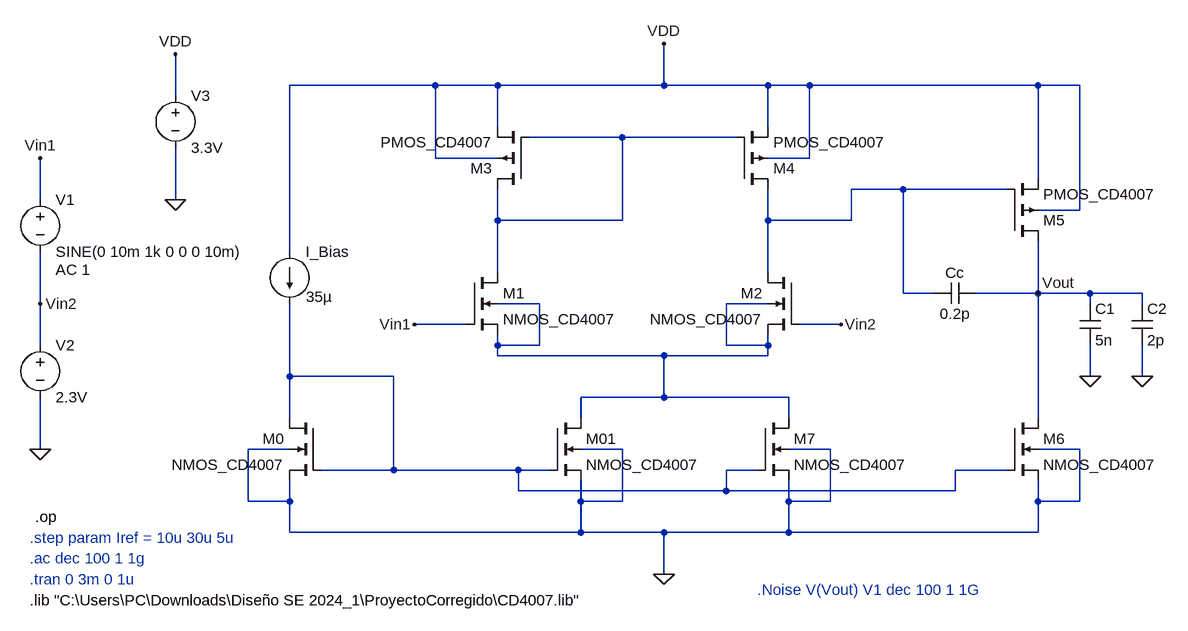
[diagram p0: schematic OTA_ADD_CurrentMirror.asc]
OTA_ADD_CurrentMirror.asc, the LTspice schematic file:
Version 4
SHEET 1 1976 948
WIRE 832 -64 608 -64
WIRE 928 -64 832 -64
WIRE 1184 -64 1184 -128
WIRE 1184 -64 928 -64
WIRE 1344 -64 1184 -64
WIRE 1408 -64 1344 -64
WIRE 1760 -64 1408 -64
WIRE 1824 -64 1760 -64
WIRE 432 -48 432 -112
WIRE 928 0 928 -64
WIRE 1344 0 1344 -64
WIRE 1120 16 976 16
WIRE 1296 16 1120 16
WIRE 832 48 832 -64
WIRE 928 48 832 48
WIRE 1408 48 1408 -64
WIRE 1408 48 1344 48
WIRE 1760 80 1760 -64
WIRE 1552 96 1472 96
WIRE 1712 96 1552 96
WIRE 224 112 224 48
WIRE 432 112 432 32
WIRE 1824 128 1824 -64
WIRE 1824 128 1760 128
WIRE 928 144 928 96
WIRE 1120 144 1120 16
WIRE 1120 144 928 144
WIRE 1344 144 1344 96
WIRE 1472 144 1472 96
WIRE 1472 144 1344 144
WIRE 608 192 608 -64
WIRE 928 224 928 144
WIRE 1344 224 1344 144
WIRE 1552 256 1552 96
WIRE 1600 256 1552 256
WIRE 1760 256 1760 176
WIRE 1760 256 1664 256
WIRE 1840 256 1760 256
WIRE 1920 256 1840 256
WIRE 224 272 224 192
WIRE 992 272 928 272
WIRE 1344 272 1280 272
WIRE 1840 272 1840 256
WIRE 1920 272 1920 256
WIRE 880 304 800 304
WIRE 1456 304 1392 304
WIRE 224 336 224 272
WIRE 928 336 928 320
WIRE 992 336 992 272
WIRE 992 336 928 336
WIRE 1280 336 1280 272
WIRE 1344 336 1344 320
WIRE 1344 336 1280 336
WIRE 928 352 928 336
WIRE 1184 352 928 352
WIRE 1344 352 1344 336
WIRE 1344 352 1184 352
WIRE 608 384 608 272
WIRE 768 384 608 384
WIRE 1840 384 1840 336
WIRE 1920 384 1920 336
WIRE 1184 416 1184 352
WIRE 1184 416 1056 416
WIRE 1376 416 1184 416
WIRE 608 448 608 384
WIRE 1056 448 1056 416
WIRE 1376 448 1376 416
WIRE 1760 448 1760 256
WIRE 224 496 224 416
WIRE 608 496 544 496
WIRE 1120 496 1056 496
WIRE 1440 496 1376 496
WIRE 1824 496 1760 496
WIRE 768 528 768 384
WIRE 768 528 656 528
WIRE 960 528 768 528
WIRE 1008 528 960 528
WIRE 1328 528 1280 528
WIRE 1712 528 1632 528
WIRE 960 560 960 528
WIRE 1280 560 1280 528
WIRE 1280 560 960 560
WIRE 1632 560 1632 528
WIRE 1632 560 1280 560
WIRE 544 576 544 496
WIRE 608 576 608 544
WIRE 608 576 544 576
WIRE 1056 576 1056 544
WIRE 1120 576 1120 496
WIRE 1120 576 1056 576
WIRE 1376 576 1376 544
WIRE 1440 576 1440 496
WIRE 1440 576 1376 576
WIRE 1760 576 1760 544
WIRE 1824 576 1824 496
WIRE 1824 576 1760 576
WIRE 608 624 608 576
WIRE 1056 624 1056 576
WIRE 1056 624 608 624
WIRE 1184 624 1056 624
WIRE 1376 624 1376 576
WIRE 1376 624 1184 624
WIRE 1760 624 1760 576
WIRE 1760 624 1376 624
WIRE 1184 688 1184 624
FLAG 1184 -128 VDD
FLAG 432 -112 VDD
FLAG 800 304 Vin1
FLAG 224 48 Vin1
FLAG 1456 304 Vin2
FLAG 224 272 Vin2
FLAG 432 112 0
FLAG 1184 688 0
FLAG 224 496 0
FLAG 1840 384 0
FLAG 1920 384 0
FLAG 1760 256 Vout
DATAFLAG 1184 352 ""
DATAFLAG 928 160 ""
DATAFLAG 1344 160 ""
DATAFLAG 608 384 ""
DATAFLAG 1280 560 ""
DATAFLAG 1536 160 ""
DATAFLAG 848 304 ""
DATAFLAG 1424 304 ""
DATAFLAG 1760 256 ""
SYMBOL nmos4 880 224 R0
SYMATTR InstName M1
SYMATTR Value NMOS_CD4007
SYMATTR Value2 L=5u W=170u Ad=8500p As=8500p Pd=440u Ps=440u NRD=0.1 NRS=0.1
SYMBOL nmos4 1392 224 M0
SYMATTR InstName M2
SYMATTR Value NMOS_CD4007
SYMATTR Value2 L=5u W=170u Ad=8500p As=8500p Pd=440u Ps=440u NRD=0.1 NRS=0.1
SYMBOL pmos4 976 96 R180
SYMATTR InstName M3
SYMATTR Value PMOS_CD4007
SYMATTR Value2 L=5u W=360u Ad=18000p As=18000p Pd=820u Ps=820u NRS=0.54 NRD=0.54
SYMBOL pmos4 1296 96 M180
SYMATTR InstName M4
SYMATTR Value PMOS_CD4007
SYMATTR Value2 L=5u W=360u Ad=18000p As=18000p Pd=820u Ps=820u NRS=0.54 NRD=0.54
SYMBOL pmos4 1712 176 M180
SYMATTR InstName M5
SYMATTR Value PMOS_CD4007
SYMATTR Value2 L=5u W=360u Ad=18000p As=18000p Pd=820u Ps=820u NRS=0.54 NRD=0.54
SYMBOL nmos4 1712 448 R0
SYMATTR InstName M6
SYMATTR Value NMOS_CD4007
SYMATTR Value2 L=5u W=170u Ad=8500p As=8500p Pd=440u Ps=440u NRD=0.1 NRS=0.1
SYMBOL nmos4 1328 448 R0
SYMATTR InstName M7
SYMATTR Value NMOS_CD4007
SYMATTR Value2 L=5u W=170u Ad=8500p As=8500p Pd=440u Ps=440u NRD=0.1 NRS=0.1
SYMBOL nmos4 656 448 M0
SYMATTR InstName M0
SYMATTR Value NMOS_CD4007
SYMATTR Value2 L=5u W=170u Ad=8500p As=8500p Pd=440u Ps=440u NRD=0.1 NRS=0.1
SYMBOL nmos4 1008 448 R0
SYMATTR InstName M01
SYMATTR Value NMOS_CD4007
SYMATTR Value2 L=5u W=170u Ad=8500p As=8500p Pd=440u Ps=440u NRD=0.1 NRS=0.1
SYMBOL cap 1664 240 R90
WINDOW 0 0 32 VBottom 2
WINDOW 3 32 32 VTop 2
SYMATTR InstName Cc
SYMATTR Value 0.2p
SYMBOL current 608 192 R0
WINDOW 3 25 69 Left 2
WINDOW 123 0 0 Left 0
WINDOW 39 0 0 Left 0
SYMATTR Value 35µ
SYMATTR InstName I_Bias
SYMBOL voltage 224 96 R0
WINDOW 123 24 124 Left 2
WINDOW 39 0 0 Left 0
SYMATTR Value2 AC 1
SYMATTR InstName V1
SYMATTR Value SINE(0 10m 1k 0 0 0 10m)
SYMBOL voltage 224 320 R0
WINDOW 123 24 124 Left 2
WINDOW 39 0 0 Left 0
SYMATTR InstName V2
SYMATTR Value 2.3V
SYMBOL voltage 432 -64 R0
WINDOW 123 0 0 Left 0
WINDOW 39 0 0 Left 0
SYMATTR InstName V3
SYMATTR Value 3.3V
SYMBOL cap 1824 272 R0
SYMATTR InstName C1
SYMATTR Value 5n
SYMBOL cap 1904 272 R0
SYMATTR InstName C2
SYMATTR Value 2p
TEXT 208 728 Left 2 !.lib "C:\\Users\\PC\\Downloads\\Diseño SE 2024_1\\ProyectoCorregido\\CD4007.lib"
TEXT 208 696 Left 2 ;.tran 0 3m 0 1u
TEXT 208 664 Left 2 ;.ac dec 100 1 1g
TEXT 208 632 Left 2 ;.step param Iref = 10u 30u 5u
TEXT 216 600 Left 2 !.op
TEXT 1328 712 Left 2 ;.Noise V(Vout) V1 dec 100 1 1G

The netlist it stands for:
* OTA_ADD_CurrentMirror.asc
M1 N001 Vin1 N003 N003 NMOS_CD4007 L=5u W=170u Ad=8500p As=8500p Pd=440u Ps=440u NRD=0.1 NRS=0.1
M2 N002 Vin2 N003 N003 NMOS_CD4007 L=5u W=170u Ad=8500p As=8500p Pd=440u Ps=440u NRD=0.1 NRS=0.1
M3 N001 N001 VDD VDD PMOS_CD4007 L=5u W=360u Ad=18000p As=18000p Pd=820u Ps=820u NRS=0.54 NRD=0.54
M4 N002 N001 VDD VDD PMOS_CD4007 L=5u W=360u Ad=18000p As=18000p Pd=820u Ps=820u NRS=0.54 NRD=0.54
M5 Vout N002 VDD VDD PMOS_CD4007 L=5u W=360u Ad=18000p As=18000p Pd=820u Ps=820u NRS=0.54 NRD=0.54
M6 Vout N004 0 0 NMOS_CD4007 L=5u W=170u Ad=8500p As=8500p Pd=440u Ps=440u NRD=0.1 NRS=0.1
M7 N003 N004 0 0 NMOS_CD4007 L=5u W=170u Ad=8500p As=8500p Pd=440u Ps=440u NRD=0.1 NRS=0.1
M0 N004 N004 0 0 NMOS_CD4007 L=5u W=170u Ad=8500p As=8500p Pd=440u Ps=440u NRD=0.1 NRS=0.1
M01 N003 N004 0 0 NMOS_CD4007 L=5u W=170u Ad=8500p As=8500p Pd=440u Ps=440u NRD=0.1 NRS=0.1
Cc Vout N002 0.2p
I_Bias VDD N004 35µ
V1 Vin1 Vin2 SINE(0 10m 1k 0 0 0 10m) AC 1
V2 Vin2 0 2.3V
V3 VDD 0 3.3V
C1 Vout 0 5n
C2 Vout 0 2p
.model NMOS NMOS
.model PMOS PMOS
.lib standard.mos
.lib "C:\Users\PC\Downloads\Diseño SE 2024_1\ProyectoCorregido\CD4007.lib"
* .tran 0 3m 0 1u
* .ac dec 100 1 1g
* .step param Iref = 10u 30u 5u
.op
* .Noise V(Vout) V1 dec 100 1 1G
.backanno
.end